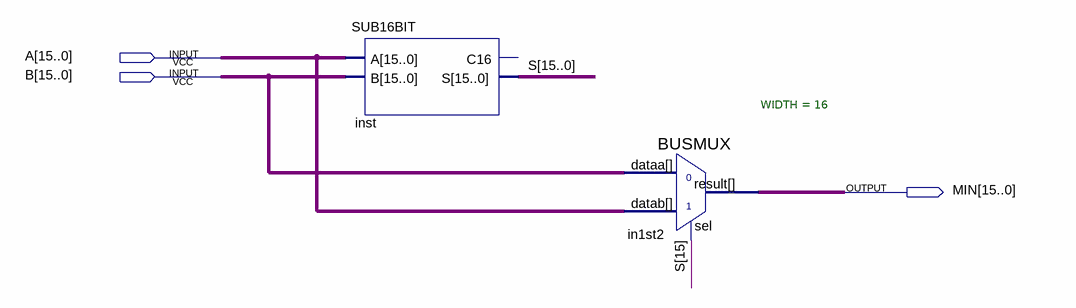
[diagram p0: schematic sheet]
// Quartus schematic MIN.bdf as structural Verilog: 2 symbols, 3 pins
module MIN (
  input  [15:0] A,
  input  [15:0] B,
  output [15:0] MIN
);

  wire [15:0] S;

  SUB16BIT inst (.A(A), .B(B), .S(S));  // open: C16
  BUSMUX #(.WIDTH(16)) in1st2 (.datab(A), .sel(S[15]), .dataa(B), .result(MIN));
endmodule
